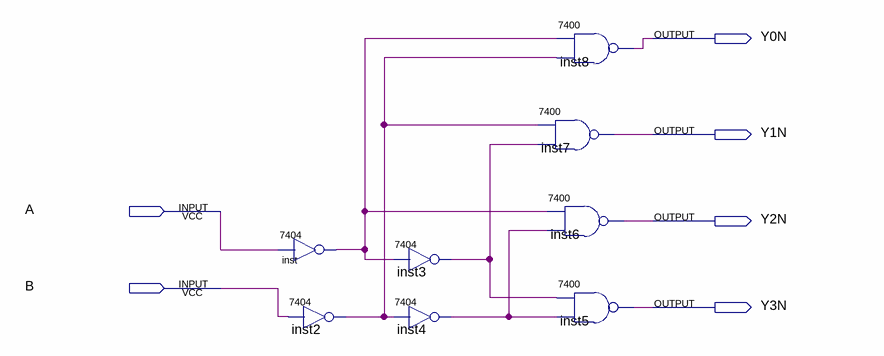
[diagram p0: schematic sheet]
// Quartus schematic Decode2to4.bdf as structural Verilog: 8 symbols, 6 pins
module Decode2to4 (
  input  A,
  input  B,
  output Y0N,
  output Y1N,
  output Y2N,
  output Y3N
);

  wire inst2_1, inst3_1, inst4_1, inst_1;

  \7404  inst (.\2 (A), .\1 (inst_1));
  \7404  inst2 (.\2 (B), .\1 (inst2_1));
  \7404  inst3 (.\2 (inst_1), .\1 (inst3_1));
  \7404  inst4 (.\2 (inst2_1), .\1 (inst4_1));
  \7400  inst7 (.\3 (inst3_1), .\2 (inst2_1), .\1 (Y1N));
  \7400  inst6 (.\3 (inst4_1), .\2 (inst_1), .\1 (Y2N));
  \7400  inst8 (.\3 (inst2_1), .\2 (inst_1), .\1 (Y0N));
  \7400  inst5 (.\3 (inst4_1), .\2 (inst3_1), .\1 (Y3N));
endmodule
